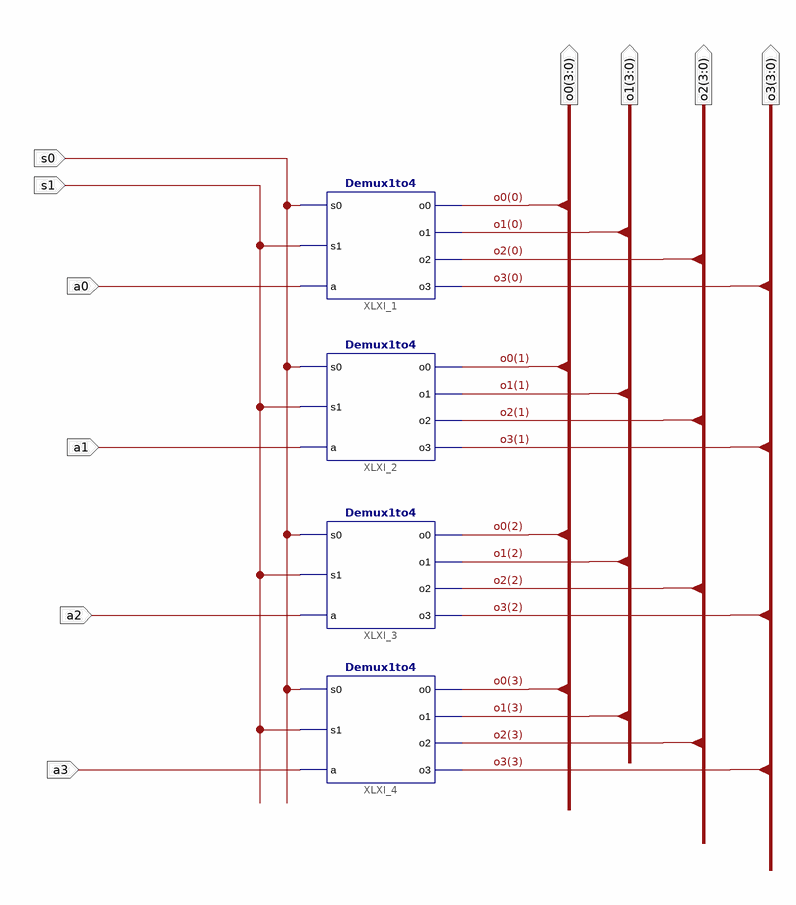
[diagram p0: schematic sheet 1]
// Xilinx ISE schematic Demux4bit.sch (spartan3e) as structural Verilog: 4 symbols, 10 ports
module Demux4bit (
  input  a0,
  input  a1,
  input  a2,
  input  a3,
  input  s0,
  input  s1,
  output [3:0] o0,
  output [3:0] o1,
  output [3:0] o2,
  output [3:0] o3
);

  Demux1to4 XLXI_1 (.s0(s0), .s1(s1), .a(a0), .o0(o0[0]), .o1(o1[0]), .o2(o2[0]), .o3(o3[0]));
  Demux1to4 XLXI_2 (.s0(s0), .s1(s1), .a(a1), .o0(o0[1]), .o1(o1[1]), .o2(o2[1]), .o3(o3[1]));
  Demux1to4 XLXI_3 (.s0(s0), .s1(s1), .a(a2), .o0(o0[2]), .o1(o1[2]), .o2(o2[2]), .o3(o3[2]));
  Demux1to4 XLXI_4 (.s0(s0), .s1(s1), .a(a3), .o0(o0[3]), .o1(o1[3]), .o2(o2[3]), .o3(o3[3]));
endmodule
